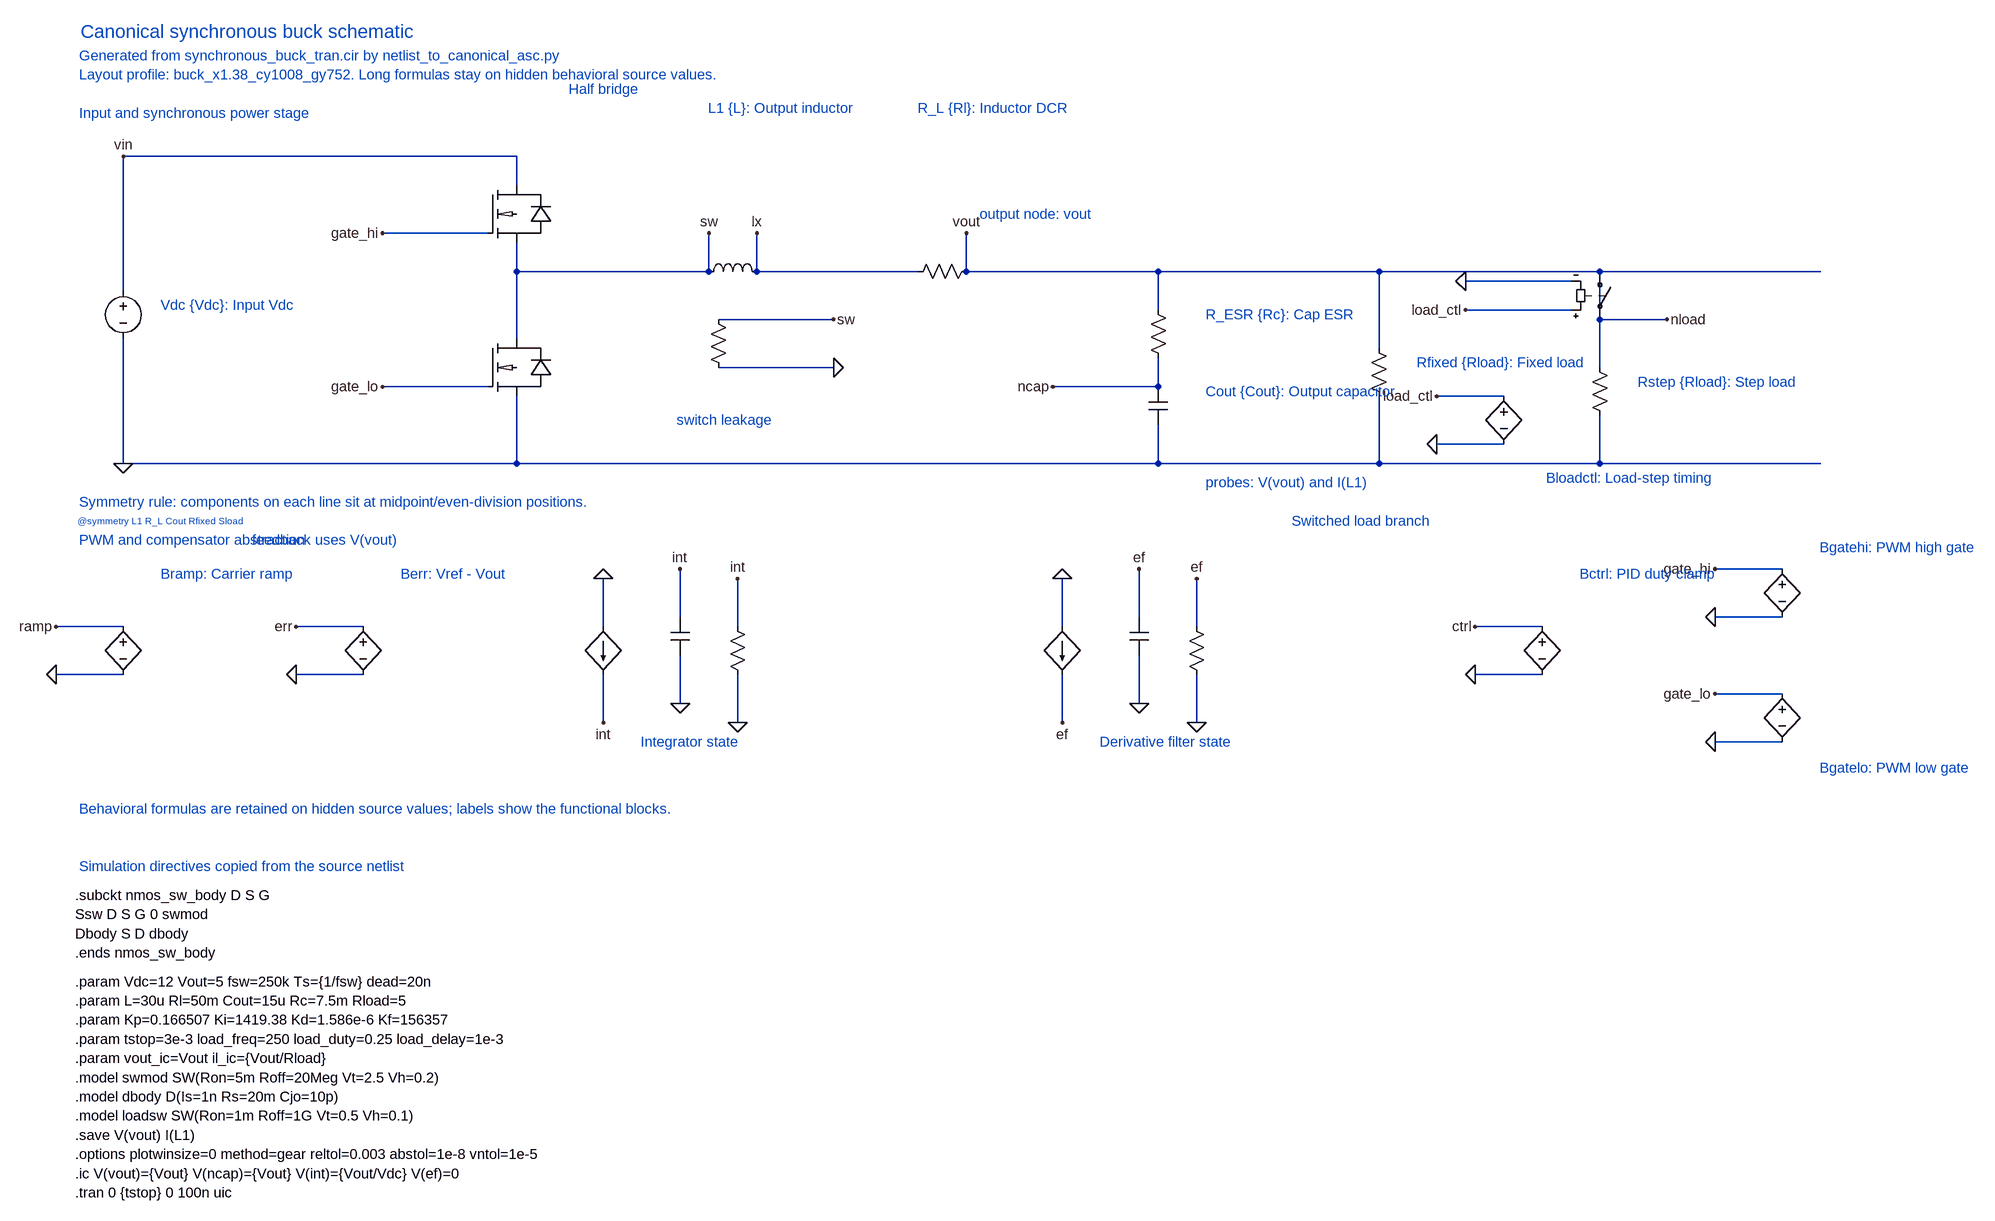
[diagram p0: schematic synchronous_buck_canonical.asc]
synchronous_buck_canonical.asc, the LTspice schematic file:
Version 4
SHEET 1 3384 2050
TEXT 80 32 Left 3 ; Canonical synchronous buck schematic
TEXT 80 72 Left 2 ; Generated from synchronous_buck_tran.cir by netlist_to_canonical_asc.py
TEXT 80 104 Left 2 ; Layout profile: buck_x1.38_cy1008_gy752. Long formulas stay on hidden behavioral source values.

TEXT 80 168 Left 2 ; Input and synchronous power stage
WIRE 160 240 816 240
WIRE 160 240 160 464
WIRE 160 544 160 752
WIRE 160 752 3024 752
WIRE 816 240 816 288
WIRE 816 384 816 432
WIRE 816 432 1136 432
WIRE 1216 432 1520 432
WIRE 1600 432 3024 432
WIRE 1216 432 1216 368
WIRE 1600 432 1600 368
WIRE 816 432 1136 432
WIRE 1136 432 1136 368
WIRE 816 432 816 544
WIRE 816 640 816 752
WIRE 1920 432 1920 496
WIRE 1920 576 1920 624
WIRE 1920 624 1744 624
WIRE 1920 688 1920 752
WIRE 2288 432 2288 560
WIRE 2288 640 2288 752
WIRE 2656 432 2656 512
WIRE 2608 496 2432 496
WIRE 2608 448 2432 448
WIRE 2656 512 2768 512
WIRE 2656 512 2656 592
WIRE 2656 672 2656 752
FLAG 160 240 vin
FLAG 1136 368 sw
FLAG 1216 368 lx
FLAG 1600 368 vout
FLAG 1744 624 ncap
FLAG 2768 512 nload
FLAG 2432 496 load_ctl
FLAG 2432 448 0
FLAG 160 752 0

SYMBOL voltage 160 448 R0
WINDOW 0 44 16 Invisible 2
WINDOW 3 44 72 Invisible 2
SYMATTR InstName Vdc
SYMATTR Value {Vdc}
TEXT 216 488 Left 2 ; Vdc {Vdc}: Input Vdc
SYMBOL nmos_sw 768 288 R0
WINDOW 0 56 32 Invisible 2
WINDOW 3 56 72 Invisible 2
SYMATTR InstName X_S_hi
SYMATTR Value nmos_sw_body
SYMBOL nmos_sw 768 544 R0
WINDOW 0 56 32 Invisible 2
WINDOW 3 56 72 Invisible 2
SYMATTR InstName X_S_lo
SYMATTR Value nmos_sw_body
WIRE 768 368 592 368
FLAG 592 368 gate_hi
WIRE 768 624 592 624
FLAG 592 624 gate_lo
TEXT 896 128 Left 2 ; Half bridge
SYMBOL res 1136 496 R0
WINDOW 0 44 16 Invisible 2
WINDOW 3 44 72 Invisible 2
SYMATTR InstName Rswleak
SYMATTR Value 1Meg
WIRE 1152 512 1344 512
WIRE 1152 592 1344 592
FLAG 1344 512 sw
FLAG 1344 592 0
TEXT 1076 680 Left 2 ; switch leakage
SYMBOL ind 1120 448 R270
WINDOW 0 44 16 Invisible 2
WINDOW 3 44 72 Invisible 2
SYMATTR InstName L1
SYMATTR Value {L}
SYMATTR SpiceLine ic={il_ic}
SYMBOL res 1504 448 R270
WINDOW 0 44 16 Invisible 2
WINDOW 3 44 72 Invisible 2
SYMATTR InstName R_L
SYMATTR Value {Rl}
TEXT 1128 160 Left 2 ; L1 {L}: Output inductor
TEXT 1512 160 Left 2 ; R_L {Rl}: Inductor DCR
SYMBOL res 1904 480 R0
WINDOW 0 44 16 Invisible 2
WINDOW 3 44 72 Invisible 2
SYMATTR InstName R_ESR
SYMATTR Value {Rc}
SYMBOL cap 1904 624 R0
WINDOW 0 44 16 Invisible 2
WINDOW 3 44 72 Invisible 2
SYMATTR InstName Cout
SYMATTR Value {Cout}
SYMATTR SpiceLine ic={vout_ic}
TEXT 1992 632 Left 2 ; Cout {Cout}: Output capacitor
TEXT 1992 504 Left 2 ; R_ESR {Rc}: Cap ESR
SYMBOL res 2272 544 R0
WINDOW 0 44 16 Invisible 2
WINDOW 3 44 72 Invisible 2
SYMATTR InstName Rfixed
SYMATTR Value {Rload}
TEXT 2344 584 Left 2 ; Rfixed {Rload}: Fixed load
SYMBOL sw 2656 416 R0
WINDOW 0 44 16 Invisible 2
WINDOW 3 44 72 Invisible 2
SYMATTR InstName Sload
SYMATTR Value loadsw
SYMBOL res 2640 576 R0
WINDOW 0 44 16 Invisible 2
WINDOW 3 44 72 Invisible 2
SYMATTR InstName Rstep
SYMATTR Value {Rload}
TEXT 2136 848 Left 2 ; Switched load branch
TEXT 2712 616 Left 2 ; Rstep {Rload}: Step load
TEXT 1616 336 Left 2 ; output node: vout
TEXT 1992 784 Left 2 ; probes: V(vout) and I(L1)
TEXT 80 816 Left 2 ; Symmetry rule: components on each line sit at midpoint/even-division positions.
TEXT 80 848 Left 1 ; @symmetry L1 R_L Cout Rfixed Sload

TEXT 80 880 Left 2 ; PWM and compensator abstraction
TEXT 368 880 Left 2 ; feedback uses V(vout)
SYMBOL bv 160 1008 R0
WINDOW 0 44 16 Invisible 2
WINDOW 3 44 72 Invisible 2
SYMATTR InstName Bramp
SYMATTR Value V={time/Ts-floor(time/Ts)}
WIRE 160 1024 48 1024
WIRE 160 1104 48 1104
FLAG 48 1024 ramp
FLAG 48 1104 0
TEXT 216 936 Left 2 ; Bramp: Carrier ramp
SYMBOL bv 560 1008 R0
WINDOW 0 44 16 Invisible 2
WINDOW 3 44 72 Invisible 2
SYMATTR InstName Berr
SYMATTR Value V={Vout - V(vout)}
WIRE 560 1024 448 1024
WIRE 560 1104 448 1104
FLAG 448 1024 err
FLAG 448 1104 0
TEXT 616 936 Left 2 ; Berr: Vref - Vout
SYMBOL bi 960 1024 R0
WINDOW 0 44 16 Invisible 2
WINDOW 3 44 72 Invisible 2
SYMATTR InstName Bint
SYMATTR Value I={Ki*V(err)}
WIRE 960 1024 960 944
WIRE 960 1104 960 1184
FLAG 960 944 0
FLAG 960 1184 int
SYMBOL cap 1072 1008 R0
WINDOW 0 44 16 Invisible 2
WINDOW 3 44 72 Invisible 2
SYMATTR InstName Cint
SYMATTR Value 1
SYMATTR SpiceLine ic={Vout/Vdc}
WIRE 1088 1008 1088 928
WIRE 1088 1072 1088 1152
FLAG 1088 928 int
FLAG 1088 1152 0
SYMBOL res 1168 1008 R0
WINDOW 0 44 16 Invisible 2
WINDOW 3 44 72 Invisible 2
SYMATTR InstName Rint
SYMATTR Value 1G
WIRE 1184 1024 1184 944
WIRE 1184 1104 1184 1184
FLAG 1184 944 int
FLAG 1184 1184 0
TEXT 1016 1216 Left 2 ; Integrator state
SYMBOL bi 1760 1024 R0
WINDOW 0 44 16 Invisible 2
WINDOW 3 44 72 Invisible 2
SYMATTR InstName Bef
SYMATTR Value I={Kf*(V(err)-V(ef))}
WIRE 1760 1024 1760 944
WIRE 1760 1104 1760 1184
FLAG 1760 944 0
FLAG 1760 1184 ef
SYMBOL cap 1872 1008 R0
WINDOW 0 44 16 Invisible 2
WINDOW 3 44 72 Invisible 2
SYMATTR InstName Cef
SYMATTR Value 1
SYMATTR SpiceLine ic=0
WIRE 1888 1008 1888 928
WIRE 1888 1072 1888 1152
FLAG 1888 928 ef
FLAG 1888 1152 0
SYMBOL res 1968 1008 R0
WINDOW 0 44 16 Invisible 2
WINDOW 3 44 72 Invisible 2
SYMATTR InstName Ref
SYMATTR Value 1G
WIRE 1984 1024 1984 944
WIRE 1984 1104 1984 1184
FLAG 1984 944 ef
FLAG 1984 1184 0
TEXT 1816 1216 Left 2 ; Derivative filter state
SYMBOL bv 2560 1008 R0
WINDOW 0 44 16 Invisible 2
WINDOW 3 44 72 Invisible 2
SYMATTR InstName Bctrl
SYMATTR Value V={limit(Kp*V(err)+V(int)+Kd*Kf*(V(err)-V(ef)), 0.02, 0.98)}
WIRE 2560 1024 2448 1024
WIRE 2560 1104 2448 1104
FLAG 2448 1024 ctrl
FLAG 2448 1104 0
TEXT 2616 936 Left 2 ; Bctrl: PID duty clamp
SYMBOL bv 2960 912 R0
WINDOW 0 44 16 Invisible 2
WINDOW 3 44 72 Invisible 2
SYMATTR InstName Bgatehi
SYMATTR Value V={if(V(ctrl)>V(ramp)+dead/Ts, 10, 0)}
WIRE 2960 928 2848 928
WIRE 2960 1008 2848 1008
FLAG 2848 928 gate_hi
FLAG 2848 1008 0
TEXT 3016 892 Left 2 ; Bgatehi: PWM high gate
SYMBOL bv 2960 1120 R0
WINDOW 0 44 16 Invisible 2
WINDOW 3 44 72 Invisible 2
SYMATTR InstName Bgatelo
SYMATTR Value V={if(V(ctrl)<V(ramp)-dead/Ts, 10, 0)}
WIRE 2960 1136 2848 1136
WIRE 2960 1216 2848 1216
FLAG 2848 1136 gate_lo
FLAG 2848 1216 0
TEXT 3016 1260 Left 2 ; Bgatelo: PWM low gate
SYMBOL bv 2496 624 R0
WINDOW 0 44 16 Invisible 2
WINDOW 3 44 72 Invisible 2
SYMATTR InstName Bloadctl
SYMATTR Value V={if(time>=load_delay, if(time<load_delay+load_duty/load_freq, 1, 0), 0)}
WIRE 2496 640 2384 640
WIRE 2496 720 2384 720
FLAG 2384 640 load_ctl
FLAG 2384 720 0
TEXT 2560 776 Left 2 ; Bloadctl: Load-step timing
TEXT 80 1328 Left 2 ; Behavioral formulas are retained on hidden source values; labels show the functional blocks.

TEXT 80 1424 Left 2 ; Simulation directives copied from the source netlist
TEXT 80 1472 Left 2 !.subckt nmos_sw_body D S G
TEXT 80 1504 Left 2 !Ssw D S G 0 swmod
TEXT 80 1536 Left 2 !Dbody S D dbody
TEXT 80 1568 Left 2 !.ends nmos_sw_body
TEXT 80 1616 Left 2 !.param Vdc=12 Vout=5 fsw=250k Ts={1/fsw} dead=20n
TEXT 80 1648 Left 2 !.param L=30u Rl=50m Cout=15u Rc=7.5m Rload=5
TEXT 80 1680 Left 2 !.param Kp=0.166507 Ki=1419.38 Kd=1.586e-6 Kf=156357
TEXT 80 1712 Left 2 !.param tstop=3e-3 load_freq=250 load_duty=0.25 load_delay=1e-3
TEXT 80 1744 Left 2 !.param vout_ic=Vout il_ic={Vout/Rload}
TEXT 80 1776 Left 2 !.model swmod SW(Ron=5m Roff=20Meg Vt=2.5 Vh=0.2)
TEXT 80 1808 Left 2 !.model dbody D(Is=1n Rs=20m Cjo=10p)
TEXT 80 1840 Left 2 !.model loadsw SW(Ron=1m Roff=1G Vt=0.5 Vh=0.1)
TEXT 80 1872 Left 2 !.save V(vout) I(L1)
TEXT 80 1904 Left 2 !.options plotwinsize=0 method=gear reltol=0.003 abstol=1e-8 vntol=1e-5
TEXT 80 1936 Left 2 !.ic V(vout)={Vout} V(ncap)={Vout} V(int)={Vout/Vdc} V(ef)=0
TEXT 80 1968 Left 2 !.tran 0 {tstop} 0 100n uic

The netlist it stands for:
* synchronous_buck_canonical.asc
Vdc vin 0 {Vdc}
XX_S_hi vin sw gate_hi nmos_sw_body  ; pins D S G
XX_S_lo sw 0 gate_lo nmos_sw_body  ; pins D S G
Rswleak sw 0 1Meg
L1 sw lx {L} ic={il_ic}
R_L lx nload {Rl}
R_ESR nload ncap {Rc}
Cout ncap 0 {Cout} ic={vout_ic}
Rfixed nload 0 {Rload}
Sload nload nload load_ctl 0 loadsw
Rstep nload 0 {Rload}
Bramp ramp 0 V={time/Ts-floor(time/Ts)}
Berr err 0 V={Vout - V(vout)}
Bint 0 int I={Ki*V(err)}
Cint int 0 1 ic={Vout/Vdc}
Rint int 0 1G
Bef 0 ef I={Kf*(V(err)-V(ef))}
Cef ef 0 1 ic=0
Ref ef 0 1G
Bctrl ctrl 0 V={limit(Kp*V(err)+V(int)+Kd*Kf*(V(err)-V(ef)), 0.02, 0.98)}
Bgatehi gate_hi 0 V={if(V(ctrl)>V(ramp)+dead/Ts, 10, 0)}
Bgatelo gate_lo 0 V={if(V(ctrl)<V(ramp)-dead/Ts, 10, 0)}
Bloadctl load_ctl 0 V={if(time>=load_delay, if(time<load_delay+load_duty/load_freq, 1, 0), 0)}
*  Canonical synchronous buck schematic
*  Generated from synchronous_buck_tran.cir by netlist_to_canonical_asc.py
*  Layout profile: buck_x1.38_cy1008_gy752. Long formulas stay on hidden behavioral source values.
*  Input and synchronous power stage
*  Vdc {Vdc}: Input Vdc
*  Half bridge
*  switch leakage
*  L1 {L}: Output inductor
*  R_L {Rl}: Inductor DCR
*  Cout {Cout}: Output capacitor
*  R_ESR {Rc}: Cap ESR
*  Rfixed {Rload}: Fixed load
*  Switched load branch
*  Rstep {Rload}: Step load
*  output node: vout
*  probes: V(vout) and I(L1)
*  Symmetry rule: components on each line sit at midpoint/even-division positions.
*  @symmetry L1 R_L Cout Rfixed Sload
*  PWM and compensator abstraction
*  feedback uses V(vout)
*  Bramp: Carrier ramp
*  Berr: Vref - Vout
*  Integrator state
*  Derivative filter state
*  Bctrl: PID duty clamp
*  Bgatehi: PWM high gate
*  Bgatelo: PWM low gate
*  Bloadctl: Load-step timing
*  Behavioral formulas are retained on hidden source values; labels show the functional blocks.
*  Simulation directives copied from the source netlist
.subckt nmos_sw_body D S G
Ssw D S G 0 swmod
Dbody S D dbody
.ends nmos_sw_body
.param Vdc=12 Vout=5 fsw=250k Ts={1/fsw} dead=20n
.param L=30u Rl=50m Cout=15u Rc=7.5m Rload=5
.param Kp=0.166507 Ki=1419.38 Kd=1.586e-6 Kf=156357
.param tstop=3e-3 load_freq=250 load_duty=0.25 load_delay=1e-3
.param vout_ic=Vout il_ic={Vout/Rload}
.model swmod SW(Ron=5m Roff=20Meg Vt=2.5 Vh=0.2)
.model dbody D(Is=1n Rs=20m Cjo=10p)
.model loadsw SW(Ron=1m Roff=1G Vt=0.5 Vh=0.1)
.save V(vout) I(L1)
.options plotwinsize=0 method=gear reltol=0.003 abstol=1e-8 vntol=1e-5
.ic V(vout)={Vout} V(ncap)={Vout} V(int)={Vout/Vdc} V(ef)=0
.tran 0 {tstop} 0 100n uic
.backanno
.end